# Altium schematic sheet ADC_CLK.SchDoc: {Наименование}
size 420 x 297 mm; DocumentNumber: НРДЦ.ХХХХХХ.ХХХ ХХ; SheetNumber: {}; SheetTotal: {}; PageSetup: Record=PageOptions|CenterHorizontal=False|CenterVertical=False|PrintScale=0.95|XCorrection=0.00|YCorrection=0.00|PrintKind=1|BorderSize=5000000|LeftOffset=0|BottomOffset=0|Orientation=1|PaperLength=1000|PaperWidth=1000|Scale=100|PaperSource=15|PrintQuality=600|MediaType=1|DitherType=10|PaperKind=A4|PrintScaleMode=1; Rule: PcbType=ProtelPcb
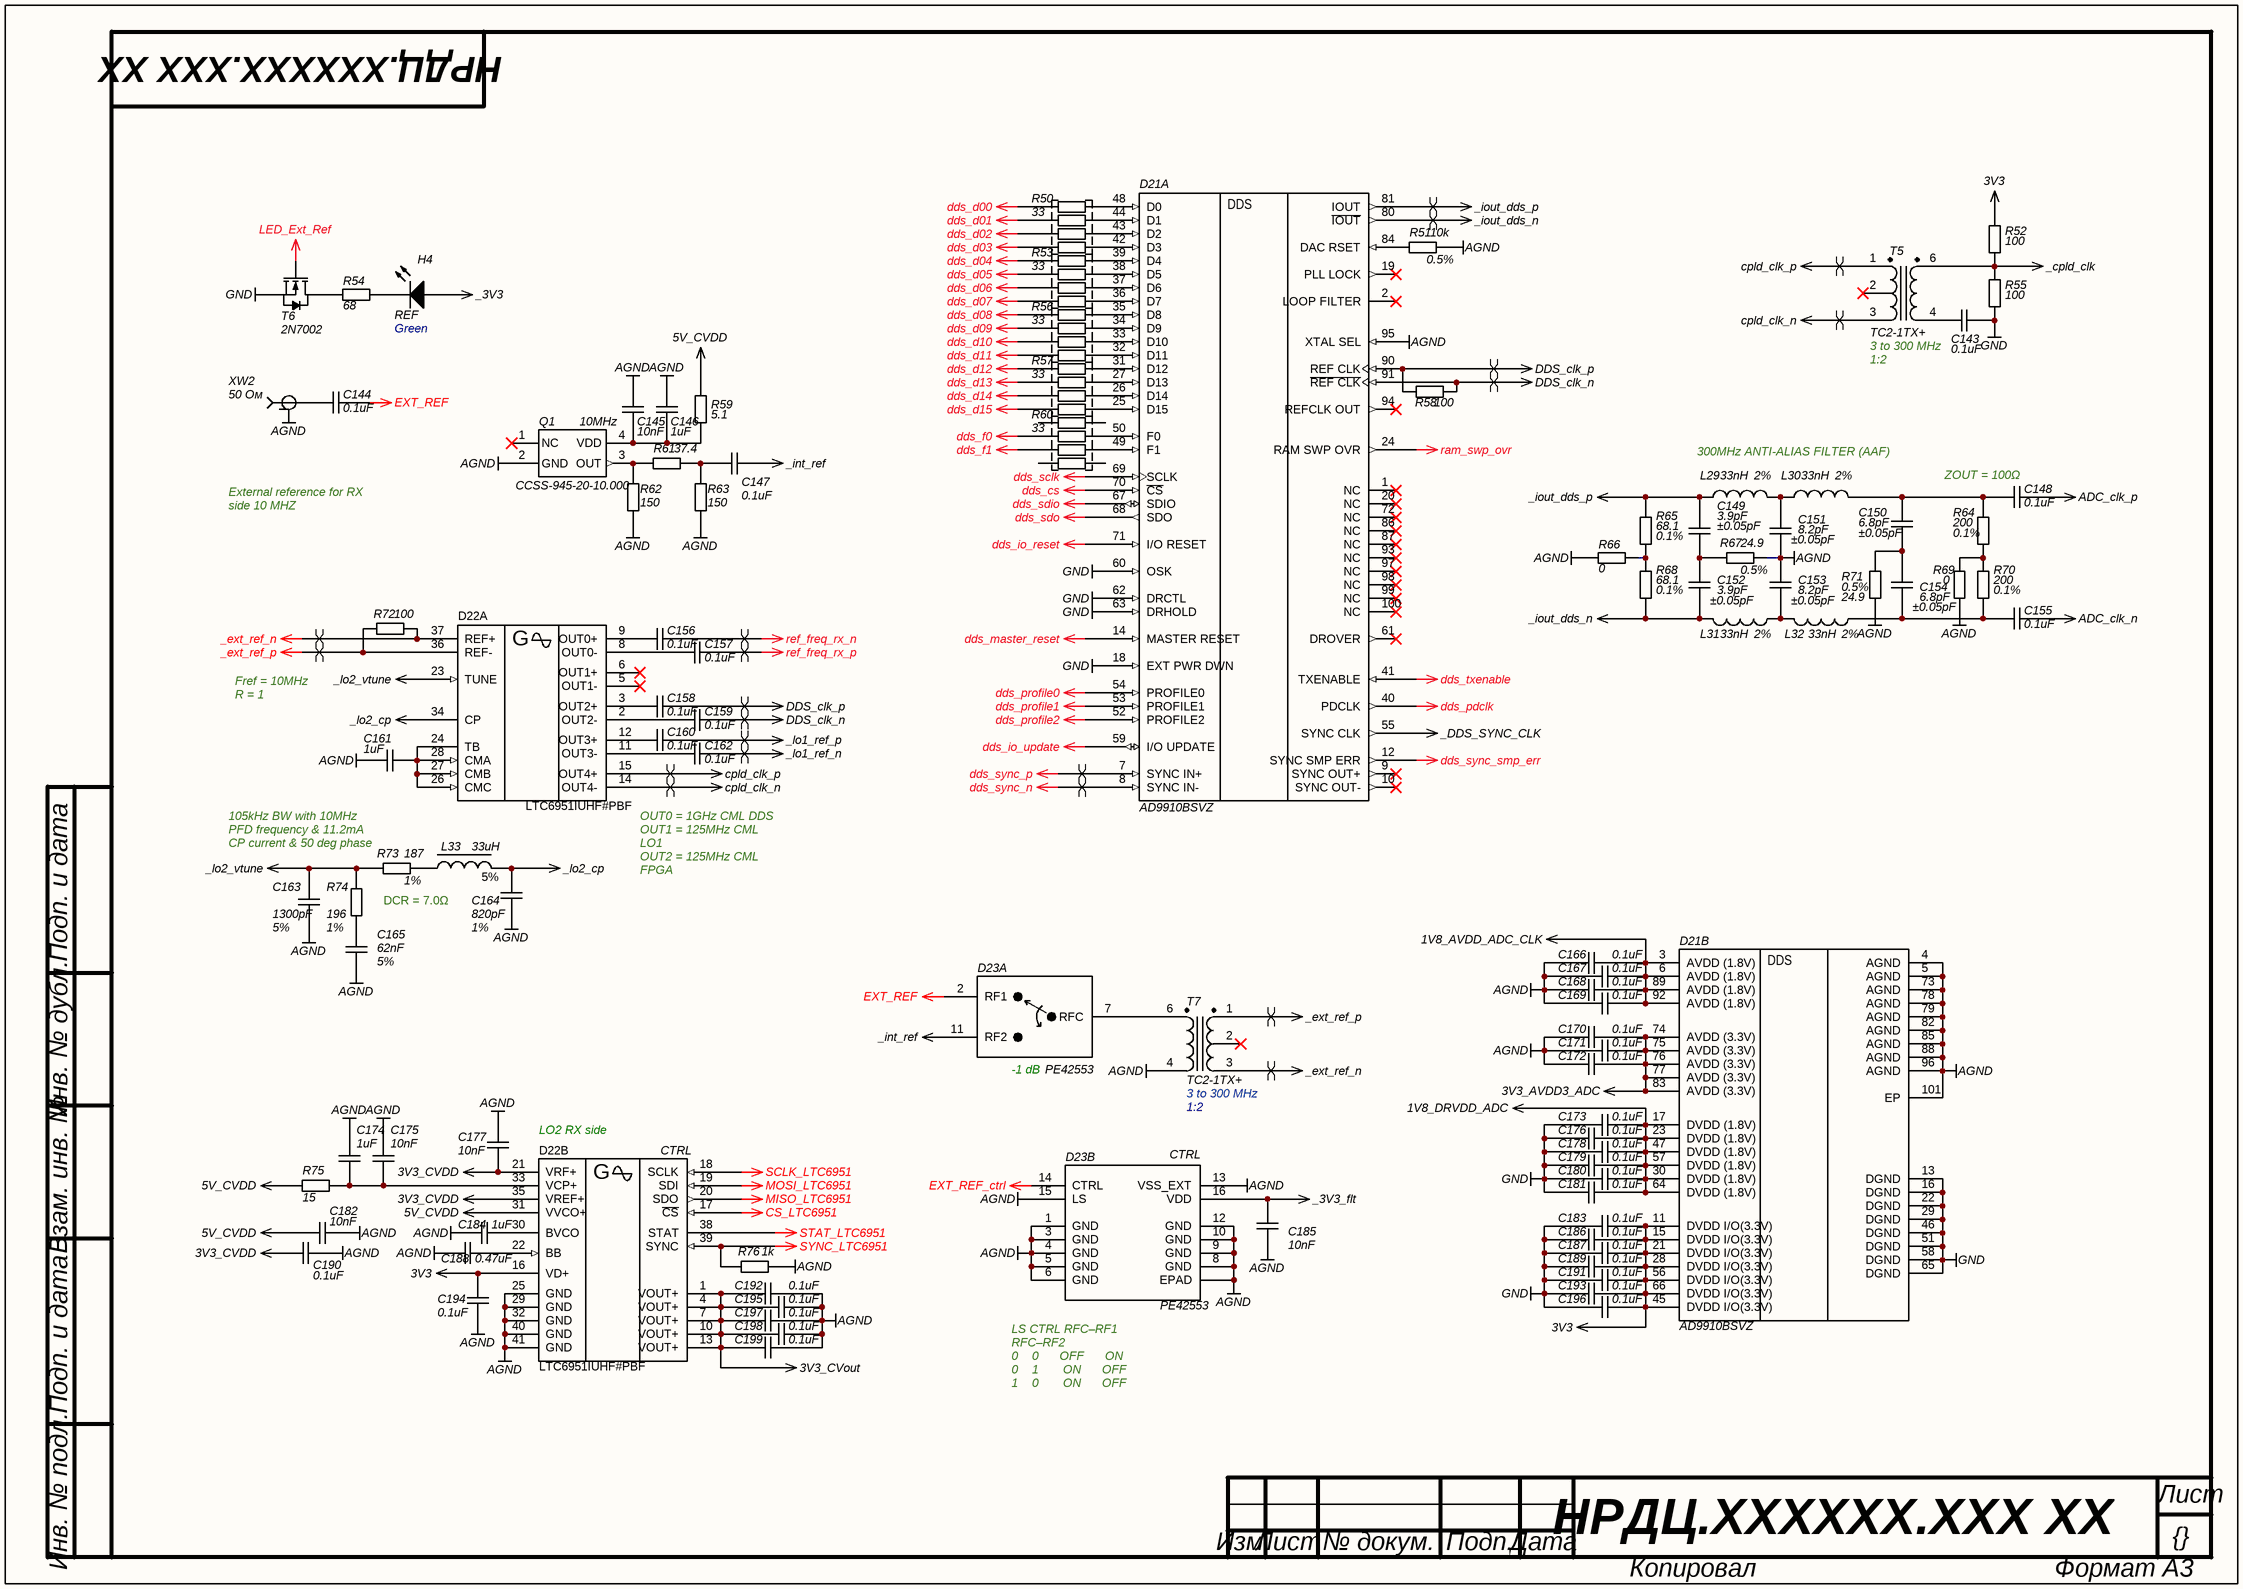
[diagram p0: ADC_CLK.SchDoc]

## Parts
C143  value 0.1uF  [C0402]  (hidden comment: CAP)
C144  value 0.1uF  [C0402]  (hidden comment: CAP)
C145  value 10nF  [C0402]  (hidden comment: CAP)
C146  value 1uF  [C0805]  (hidden comment: CAP)
C147  value 0.1uF  [C0402]  (hidden comment: CAP)
C148  value 0.1uF  [C0402]  (hidden comment: CAP)
C149  value 3.9pF  Tolerance: ±0.05pF  [C0402]  (hidden comment: CAP)
C150  value 6.8pF  Tolerance: ±0.05pF  [C0402]  (hidden comment: CAP)
C151  value 8.2pF  Tolerance: ±0.05pF  [C0402]  (hidden comment: CAP)
C152  value 3.9pF  Tolerance: ±0.05pF  [C0402]  (hidden comment: CAP)
C153  value 8.2pF  Tolerance: ±0.05pF  [C0402]  (hidden comment: CAP)
C154  value 6.8pF  Tolerance: ±0.05pF  [C0402]  (hidden comment: CAP)
C155  value 0.1uF  [C0402]  (hidden comment: CAP)
C156  value 0.1uF  [C0402]  (hidden comment: CAP)
C157  value 0.1uF  [C0402]  (hidden comment: CAP)
C158  value 0.1uF  [C0402]  (hidden comment: CAP)
C159  value 0.1uF  [C0402]  (hidden comment: CAP)
C160  value 0.1uF  [C0402]  (hidden comment: CAP)
C161  value 1uF  [C0402]  (hidden comment: CAP)
C162  value 0.1uF  [C0402]  (hidden comment: CAP)
C163  value 1300pF  Tolerance: 5%  [C0603]  (hidden comment: CAP)
C164  value 820pF  Tolerance: 1%  [C0603]  (hidden comment: CAP)
C165  value 62nF  Tolerance: 5%  [C1206]  (hidden comment: CAP)
C166  value 0.1uF  [C0402]  (hidden comment: CAP)
C167  value 0.1uF  [C0402]  (hidden comment: CAP)
C168  value 0.1uF  [C0402]  (hidden comment: CAP)
C169  value 0.1uF  [C0402]  (hidden comment: CAP)
C170  value 0.1uF  [C0402]  (hidden comment: CAP)
C171  value 0.1uF  [C0402]  (hidden comment: CAP)
C172  value 0.1uF  [C0402]  (hidden comment: CAP)
C173  value 0.1uF  [C0402]  (hidden comment: CAP)
C174  value 1uF  [C0805]  (hidden comment: CAP)
C175  value 10nF  [C0402]  (hidden comment: CAP)
C176  value 0.1uF  [C0402]  (hidden comment: CAP)
C177  value 10nF  [C0402]  (hidden comment: CAP)
C178  value 0.1uF  [C0402]  (hidden comment: CAP)
C179  value 0.1uF  [C0402]  (hidden comment: CAP)
C180  value 0.1uF  [C0402]  (hidden comment: CAP)
C181  value 0.1uF  [C0402]  (hidden comment: CAP)
C182  value 10nF  [C0402]  (hidden comment: CAP)
C183  value 0.1uF  [C0402]  (hidden comment: CAP)
C184  value 1uF  [C0402]  (hidden comment: CAP)
C185  value 10nF  [C0402]  (hidden comment: CAP)
C186  value 0.1uF  [C0402]  (hidden comment: CAP)
C187  value 0.1uF  [C0402]  (hidden comment: CAP)
C188  value 0.47uF  [C0603]  (hidden comment: CAP)
C189  value 0.1uF  [C0402]  (hidden comment: CAP)
C190  value 0.1uF  [C0402]  (hidden comment: CAP)
C191  value 0.1uF  [C0402]  (hidden comment: CAP)
C192  value 0.1uF  [C0402]  (hidden comment: CAP)
C193  value 0.1uF  [C0402]  (hidden comment: CAP)
C194  value 0.1uF  [C0402]  (hidden comment: CAP)
C195  value 0.1uF  [C0402]  (hidden comment: CAP)
C196  value 0.1uF  [C0402]  (hidden comment: CAP)
C197  value 0.1uF  [C0402]  (hidden comment: CAP)
C198  value 0.1uF  [C0402]  (hidden comment: CAP)
C199  value 0.1uF  [C0402]  (hidden comment: CAP)
D21  AD9910BSVZ  [Analog_Devices_SV-100-4_IPC_A]  (parts A,B of 2)
D22  LTC6951IUHF#PBF  [Analog_Devices_UHF-40-05-08-1951_IPC_A]  (parts A,B of 2)
D23  PE42553  [QFN-16]  (parts A,B of 2)
H4  REF  Color: Green  [LED]
L29  value 33nH  Tolerance: 2%  [L0603_HP]  (hidden comment: Inductor RF)
L30  value 33nH  Tolerance: 2%  [L0603_HP]  (hidden comment: Inductor RF)
L31  value 33nH  Tolerance: 2%  [L0603_HP]  (hidden comment: Inductor RF)
L32  value 33nH  Tolerance: 2%  [L0603_HP]  (hidden comment: Inductor RF)
L33  value 33uH  Tolerance: 5%  [L1008_LS]  (hidden comment: Inductor)
Q1  CCSS-945-20-10.000  Frequency: 10MHz  [CVCSO-914]
R50  value 33  [EXN8V]  (hidden comment: RES 4x0402)
R51  value 10k  Tolerance: 0.5%  [R0402]  (hidden comment: RES)
R52  value 100  [R0402]  (hidden comment: RES)
R53  value 33  [EXN8V]  (hidden comment: RES 4x0402)
R54  value 68  [R0402]  (hidden comment: RES)
R55  value 100  [R0402]  (hidden comment: RES)
R56  value 33  [EXN8V]  (hidden comment: RES 4x0402)
R57  value 33  [EXN8V]  (hidden comment: RES 4x0402)
R58  value 100  [R0402]  (hidden comment: RES)
R59  value 5.1  [R0603]  (hidden comment: RES)
R60  value 33  [EXN8V]  (hidden comment: RES 4x0402)
R61  value 37.4  [R0402]  (hidden comment: RES)
R62  value 150  [R0402]  (hidden comment: RES)
R63  value 150  [R0402]  (hidden comment: RES)
R64  value 200  Tolerance: 0.1%  [R0402]  (hidden comment: RES)
R65  value 68.1  Tolerance: 0.1%  [R0402]  (hidden comment: RES)
R66  value 0  [R0402]  (hidden comment: RES)
R67  value 24.9  Tolerance: 0.5%  [R0402]  (hidden comment: RES)
R68  value 68.1  Tolerance: 0.1%  [R0402]  (hidden comment: RES)
R69  value 0  [R0402]  (hidden comment: RES)
R70  value 200  Tolerance: 0.1%  [R0402]  (hidden comment: RES)
R71  value 24.9  Tolerance: 0.5%  [R0402]  (hidden comment: RES)
R72  value 100  [R0402]  (hidden comment: RES)
R73  value 187  Tolerance: 1%  [R0402]  (hidden comment: RES)
R74  value 196  Tolerance: 1%  [R0402]  (hidden comment: RES)
R75  value 15  [R0603]  (hidden comment: RES)
R76  value 1k  [R0402]  (hidden comment: RES)
T5  TC2-1TX+  Frequency: 3 to 300 MHz  Ratio: 1:2  [AT1521]
T6  2N7002  [SOT-23]
T7  TC2-1TX+  Frequency: 3 to 300 MHz  Ratio: 1:2  [AT1521]
XW2  50 Ом  [MOLEX SD-73251-135 (Gold)]

## Nets
1V8_AVDD_ADC_CLK: C166.2 C167.2 C168.2 C169.2 D21.3(AVDD_(1.8V)) D21.6(AVDD_(1.8V)) D21.89(AVDD_(1.8V)) D21.92(AVDD_(1.8V))
1V8_DRVDD_ADC: C173.2 C176.2 C178.2 C179.2 C180.2 C181.2 D21.17(DVDD_(1.8V)) D21.23(DVDD_(1.8V)) D21.30(DVDD_(1.8V)) D21.47(DVDD_(1.8V)) D21.57(DVDD_(1.8V)) D21.64(DVDD_(1.8V))
3V3: C183.2 C186.2 C187.2 C189.2 C191.2 C193.2 C194.2 C196.2 D21.11(DVDD_I/O(3.3V)) D21.15(DVDD_I/O(3.3V)) D21.21(DVDD_I/O(3.3V)) D21.28(DVDD_I/O(3.3V)) D21.45(DVDD_I/O(3.3V)) D21.56(DVDD_I/O(3.3V)) D21.66(DVDD_I/O(3.3V)) D22.16(VD+) R52.2
3V3_AVDD3_ADC: C170.2 C171.2 C172.2 D21.74(AVDD_(3.3V)) D21.75(AVDD_(3.3V)) D21.76(AVDD_(3.3V)) D21.77(AVDD_(3.3V)) D21.83(AVDD_(3.3V))
3V3_CVDD: C177.2 C190.2 D22.21(VRF+) D22.35(VREF+)
3V3_CVout: C192.1 C195.1 C197.1 C198.1 C199.1 D22.1(VOUT+) D22.4(VOUT+) D22.7(VOUT+) D22.10(VOUT+) D22.13(VOUT+)
5V_CVDD: C182.1 D22.31(VVCO+) R59.2 R75.2
_3V3: H4.2(A)
_3V3_flt: C185.1 D23.16(VDD)
_cpld_clk: R52.1 R55.2 T5.6
_DDS_SYNC_CLK: D21.55(SYNC_CLK)
_ext_ref_n: D22.37(REF+) R72.2 T7.3
_ext_ref_p: D22.36(REF-) R72.1 T7.1
_int_ref: C147.1 D23.11(RF2)
_iout_dds_n: C152.2 D21.80(~{IOUT}) L31.1 R68.2
_iout_dds_p: C149.1 D21.81(IOUT) L29.1 R65.1
_lo1_ref_n: C162.1
_lo1_ref_p: C160.1
_lo2_cp: C164.2 D22.34(CP) L33.2
_lo2_vtune: C163.2 D22.23(TUNE) R73.2 R74.1
ADC_clk_n: C155.1
ADC_clk_p: C148.1
AGND: C145.1 C146.1 C151.2 C153.1 C161.1 C163.1 C164.1 C165.1 C166.1 C167.1 C168.1 C169.1 C170.1 C171.1 C172.1 C174.1 C175.1 C177.1 C182.2 C184.1 C185.2 C188.2 C190.1 C192.2 C194.1 C195.2 C197.2 C198.2 C199.2 D21.4(AGND) D21.5(AGND) D21.73(AGND) D21.78(AGND) D21.79(AGND) D21.82(AGND) D21.85(AGND) D21.88(AGND) D21.95(XTAL_SEL) D21.96(AGND) D21.101(EP) D22.25(GND) D22.29(GND) D22.32(GND) D22.40(GND) D22.41(GND) D23.1(GND) D23.3(GND) D23.4(GND) D23.5(GND) D23.6(GND) D23.8(GND) D23.9(GND) D23.10(GND) D23.12(GND) D23.13(VSS_EXT) D23.15(LS) D23.17(EPAD) Q1.2(GND) R51.1 R62.2 R63.2 R66.1 R67.2 R69.2 R71.2 R76.1 T7.4 XW2.G(GND)
cpld_clk_n: D22.14(OUT4-) T5.3
cpld_clk_p: D22.15(OUT4+) T5.1
CS_LTC6951: D22.17(~{CS})
DDS_clk_n: C159.1 D21.91(~{REF_CLK}) R58.1
DDS_clk_p: C158.1 D21.90(REF_CLK) R58.2
dds_cs: D21.70(~{CS})
dds_d00: R50.4
dds_d01: R50.3
dds_d02: R50.2
dds_d03: R50.1
dds_d04: R53.4
dds_d05: R53.3
dds_d06: R53.2
dds_d07: R53.1
dds_d08: R56.4
dds_d09: R56.3
dds_d10: R56.2
dds_d11: R56.1
dds_d12: R57.4
dds_d13: R57.3
dds_d14: R57.2
dds_d15: R57.1
dds_f0: R60.3
dds_f1: R60.2
dds_io_reset: D21.71(I/O_RESET)
dds_io_update: D21.59(I/O_UPDATE)
dds_master_reset: D21.14(MASTER_RESET)
dds_pdclk: D21.40(PDCLK)
dds_profile0: D21.54(PROFILE0)
dds_profile1: D21.53(PROFILE1)
dds_profile2: D21.52(PROFILE2)
dds_sclk: D21.69(SCLK)
dds_sdio: D21.67(SDIO)
dds_sdo: D21.68(SDO)
dds_sync_n: D21.8(SYNC_IN-)
dds_sync_p: D21.7(SYNC_IN+)
dds_sync_smp_err: D21.12(SYNC_SMP_ERR)
dds_txenable: D21.41(TXENABLE)
EXT_REF: C144.1 D23.2(RF1)
EXT_REF_ctrl: D23.14(CTRL)
GND: C143.1 C173.1 C176.1 C178.1 C179.1 C180.1 C181.1 C183.1 C186.1 C187.1 C189.1 C191.1 C193.1 C196.1 D21.13(DGND) D21.16(DGND) D21.18(EXT_PWR_DWN) D21.22(DGND) D21.29(DGND) D21.46(DGND) D21.51(DGND) D21.58(DGND) D21.60(OSK) D21.62(DRCTL) D21.63(DRHOLD) D21.65(DGND) R55.1 T6.2(S)
LED_Ext_Ref: T6.1(G)
MISO_LTC6951: D22.20(SDO)
MOSI_LTC6951: D22.19(SDI)
ram_swp_ovr: D21.24(RAM_SWP_OVR)
ref_freq_rx_n: C156.1
ref_freq_rx_p: C157.1
SCLK_LTC6951: D22.18(SCLK)
STAT_LTC6951: D22.38(STAT)
SYNC_LTC6951: D22.39(SYNC) R76.2
NetC143_2: C143.2 T5.4
NetC144_2: C144.2 XW2.S(RF)
NetC145_2: C145.2 C146.2 Q1.4(VDD) R59.1
NetC147_2: C147.2 R61.1 R63.1
NetC148_2: C148.2 C150.1 L30.2 R64.1
NetC149_2: C149.2 C152.1 R67.1
NetC150_2: C150.2 C154.1 R71.1
NetC151_1: C151.1 L29.2 L30.1
NetC153_2: C153.2 L31.2 L32.1
NetC154_2: C154.2 C155.2 L32.2 R70.2
NetC156_2: C156.2 D22.9(OUT0+)
NetC157_2: C157.2 D22.8(OUT0-)
NetC158_2: C158.2 D22.3(OUT2+)
NetC159_2: C159.2 D22.2(OUT2-)
NetC160_2: C160.2 D22.12(OUT3+)
NetC161_2: C161.2 D22.24(TB) D22.26(CMC) D22.27(CMB) D22.28(CMA)
NetC162_2: C162.2 D22.11(OUT3-)
NetC165_2: C165.2 R74.2
NetC174_2: C174.2 C175.2 D22.33(VCP+) R75.1
NetC184_2: C184.2 D22.30(BVCO)
NetC188_1: C188.1 D22.22(BB)
NetD21_25: D21.25(D15) R57.8
NetD21_26: D21.26(D14) R57.7
NetD21_27: D21.27(D13) R57.6
NetD21_31: D21.31(D12) R57.5
NetD21_32: D21.32(D11) R56.8
NetD21_33: D21.33(D10) R56.7
NetD21_34: D21.34(D9) R56.6
NetD21_35: D21.35(D8) R56.5
NetD21_36: D21.36(D7) R53.8
NetD21_37: D21.37(D6) R53.7
NetD21_38: D21.38(D5) R53.6
NetD21_39: D21.39(D4) R53.5
NetD21_42: D21.42(D3) R50.8
NetD21_43: D21.43(D2) R50.7
NetD21_44: D21.44(D1) R50.6
NetD21_48: D21.48(D0) R50.5
NetD21_49: D21.49(F1) R60.7
NetD21_50: D21.50(F0) R60.6
NetD21_84: D21.84(DAC_RSET) R51.2
NetD23_7: D23.7(RFC) T7.6
NetH4_1: H4.1(K) R54.1
NetL33_1: L33.1 R73.1
NetQ1_3: Q1.3(OUT) R61.2 R62.1
NetR54_2: R54.2 T6.3(D)
NetR64_2: R64.2 R69.1 R70.1
NetR65_2: R65.2 R66.2 R68.1

Not connected (* = marked no-connect by the designer): D21 1(NC)* 2(LOOP_FILTER)* 9(SYNC_OUT+)* 10(SYNC_OUT-)* 19(PLL_LOCK)* 20(NC)* 61(DROVER)* 72(NC)* 86(NC)* 87(NC)* 93(NC)* 94(REFCLK_OUT)* 97(NC)* 98(NC)* 99(NC)* 100(NC)*; D22 5(OUT1-)* 6(OUT1+)*; Q1 1(NC)*; R60 1 4 5 8; T5 2*; T7 2*

## Layout directives
differential pair: _ext_ref_n, _ext_ref_p, _iout_dds_n, _iout_dds_p, _lo1_ref_n, _lo1_ref_p, cpld_clk_n, cpld_clk_p, DDS_clk_n, DDS_clk_p, dds_sync_n, dds_sync_p, ref_freq_rx_n, ref_freq_rx_p

## Notes on the sheet
- External reference for RX side 10 MHZ
- 300MHz ANTI-ALIAS FILTER (AAF)
- (near C148) ZOUT = 100Ω
- Fref = 10MHz
  R = 1
- (near R73) 105kHz BW with 10MHz PFD frequency & 11.2mA CP current & 50 deg phase margin
- DCR = 7.0Ω
- OUT0 = 1GHz CML DDS
  OUT1 = 125MHz CML LO1
  OUT2 = 125MHz CML FPGA
  OUT3 = NC CML
  OUT4 = 62.5MHz LVDS CPLD
- LO2 RX side
- (near D23) LS CTRL RFC–RF1 RFC–RF2
  0    0      OFF      ON
  0    1       ON      OFF
  1    0       ON      OFF
  1    1      OFF      ON
- Подп. и дата
- Инв. № дубл.
- Взам. инв. №
- Инв. № подл.
- Лист
- Изм.
- № докум.
- Подп.
- Дата
- Копировал
- Формат А3
- (in symbol AD9910, part A) DDS
- (in symbol AD9910, part B) DDS
- (in symbol LTC6951, part A) G
- (in symbol LTC6951, part B) CTRL; G
- (in symbol PE42553, part A) -1 dB

## Library data of the parts
C143 C144 C147 C148 C155-C160 C162 C190 C194 = CAP: SMD Capacitor; Manufacturer: Murata; Material: X7R; Tolerance: 10%; Voltage: 10V; Type: Ceramic Capacitor; P/N: GRM155R71A104KA01J
C145 C175 C177 C182 C185 = CAP: SMD Capacitor; Manufacturer: Murata; Material: X7R; Tolerance: 10%; Voltage: 25V; Type: Ceramic Capacitor; P/N: GRM155R71E103KA01D
C146 C174 = CAP: SMD Capacitor; Manufacturer: Murata; Material: X7R; Tolerance: 10%; Voltage: 10V; Type: Ceramic Capacitor; P/N: GRM21BR71A105KA01K
C149 C152 = CAP: SMD Capacitor; Manufacturer: Murata; Material: NP0; Voltage: 50V; Type: Ceramic Capacitor; P/N: GJM1555C1H3R9WB01D
C150 C154 = CAP: SMD Capacitor; Manufacturer: Murata; Material: NP0; Voltage: 50V; Type: Ceramic Capacitor; P/N: GJM1555C1H6R8WB01D
C151 C153 = CAP: SMD Capacitor; Manufacturer: Murata; Material: NP0; Voltage: 50V; Type: Ceramic Capacitor; P/N: GJM1555C1H8R2WB01D
C161 C184 = CAP: SMD Capacitor; Manufacturer: Murata; Material: X7R; Tolerance: 10%; Voltage: 6.3V; Type: Ceramic Capacitor; P/N: GRM155R70J105KA12J
C163 = CAP: SMD Capacitor; Manufacturer: Murata; Material: NP0; Voltage: 50V; Type: Ceramic Capacitor; P/N: GRM1885C1H132JA01D
C164 = CAP: SMD Capacitor; Manufacturer: Murata; Material: NP0; Voltage: 100V; Type: Ceramic Capacitor; P/N: GCM1885C2A821FA16D
C165 = CAP: SMD Capacitor; Manufacturer: Murata; Material: NP0; Voltage: 50V; Type: Ceramic Capacitor; P/N: GRM31C5C1H623JA01K
C166-C173 C176 C178-C181 C183 C186 C187 C189 C191-C193 C195-C199 = CAP: SMD Capacitor; Manufacturer: Murata; Material: X7R; Tolerance: 10%; Voltage: 16V; Type: Ceramic Capacitor; P/N: GRM155R71C104KA88J
C188 = CAP: SMD Capacitor; Manufacturer: Murata; Material: X7R; Tolerance: 10%; Voltage: 16V; Type: Ceramic Capacitor; P/N: GCM188R71C474KA55D
D21 = AD9910: 1 GSPS, 14-Bit, 3.3 V CMOS / Direct Digital Synthesizer; P/N: AD9910BSVZ; Name: AD9910
D22 = LTC6951: Ultralow Jitter / Multioutput Clock Synthesizer / with Integrated VCO; Name: LTC6951; P/N: LTC6951IUHF#PBF
D23 = PE42553: HaRPTM technology-enhanced absorptive SPDT; Manufacturer: Peregrine Technical Solutions; P/N: PE42553A-Z; Type: SPDT RF Switch; Name: PE42553; Package: 16-lead 3 × 3 mm QFN; Supplier 1: Digi-Key; Supplier Part Number 1: 1046-1137-1-ND
H4 = LED: CHIP LED LAMP; Manufacturer: Kingbright; Name: APHCM2012; P/N: APHCM2012CGCK-F01; Package: 2.0 x 1.25 mm SMD; Type: CHIP LED LAMP; Supplier 1: Digi-Key; Supplier Part Number 1: 754-1094-1-ND
L29-L32 = Inductor RF: Chip SMD Inductor; Manufacturer: Coilcraft; Current: 680mA; Frequency: 2.7GHz; Name: 0603HP-33NXGE; Series: 0603HP; Temperature Range: -25…85°C; P/N: 0603HP-33NXGE
L33 = Inductor: Chip SMD Inductor; Manufacturer: Coilcraft; Current: 200mA; Frequency: 32MHz; Name: 1008LS; P/N: 1008LS-333XJE; DCR: 7.0Ω; Series: 1008LS; Temperature Range: -25…85°C
Q1 = CCSS-945: Ultra Low Noise / SineWave Clock Oscillator; Input Current: 15mA Typical; Name: CCSS-945-10; Output: Unsymmetry; Output Current: ±24mA Max; Voltage: 5.0V; Package: 9×14 mm SMD; Temperature Range: 0°C to +70°C; P/N: CCSS-945-20-10.000; Type: SineWave Clock Oscillator
R50 R53 R56 R57 R60 = RES 4x0402: Chip Resistor Array; Manufacturer: Panasonic; Name: EXBN8V; Number of Resistors: 4; Tolerance: 5%; P/N: ERJ-2GEJ330X; Type: 0402 Array Concave Terminal; Number of Terminals: 8; Series: EXB
R51 = RES: SMD Resistor; Manufacturer: Panasonic Electronic Components; Name: Chip SMD Resistor; Power: 0.063 Wt; P/N: ERA-2AED103X; Temperature Range: -55…155°C
R52 R55 R58 R72 = RES: SMD Resistor; Manufacturer: Panasonic Electronic Components; Name: Chip SMD Resistor; Power: 0.062 Wt; Tolerance: 5%; P/N: ERJ-2GEJ101X; Temperature Range: -55…155°C
R54 = RES: SMD Resistor; Name: Chip SMD Resistor; Power: 0.062 Wt; Tolerance: 5%; P/N: ERJ-2GEJ680X; Temperature Range: -55…155°C
R59 = RES: SMD Resistor; Name: Chip SMD Resistor; Power: 0.1 Wt; Tolerance: 5%; P/N: ERJ-2GEJ5R1X; Temperature Range: -55…155°C
R61 = RES: SMD Resistor; Manufacturer: Panasonic Electronic Components; Name: Chip SMD Resistor; Power: 0.062 Wt; Tolerance: 5%; P/N: ERJ-2RKF37R4X; Temperature Range: -55…155°C
R62 R63 = RES: SMD Resistor; Manufacturer: Panasonic Electronic Components; Name: Chip SMD Resistor; Power: 0.062 Wt; Tolerance: 1%; P/N: ERJ-2RKF1500X; Temperature Range: -55…155°C
R64 R70 = RES: SMD Resistor; Manufacturer: Panasonic Electronic Components; Name: Chip SMD Resistor; Power: 0.063 Wt; P/N: ERA-2AEB201X; Temperature Range: -55…155°C
R65 R68 = RES: SMD Resistor; Manufacturer: Panasonic Electronic Components; Name: Chip SMD Resistor; Power: 0.063 Wt; P/N: ERA-2AEB68R1X; Temperature Range: -55…155°C
R66 R69 = RES: SMD Resistor; Name: Chip SMD Resistor; Power: 0.1 Wt; Tolerance: 1%; P/N: ERJ-2GE0R00X; Temperature Range: -55…155°C
R67 R71 = RES: SMD Resistor; Manufacturer: Panasonic Electronic Components; Name: Chip SMD Resistor; Power: 0.063 Wt; P/N: ERJ-2RKD24R9X; Temperature Range: -55…155°C
R73 = RES: SMD Resistor; Manufacturer: Panasonic Electronic Components; Name: Chip SMD Resistor; Power: 0.2 Wt; P/N: ERJ-2RKF1870X; Temperature Range: -55…155°C
R74 = RES: SMD Resistor; Manufacturer: Panasonic Electronic Components; Name: Chip SMD Resistor; Power: 0.2 Wt; P/N: ERJ-2RKF1960X; Temperature Range: -55…155°C
R75 = RES: SMD Resistor; Name: Chip SMD Resistor; Power: 0.1 Wt; Tolerance: 1%; P/N: ERJ-3EKF15R0V; Temperature Range: -55…155°C
R76 = RES: SMD Resistor; Manufacturer: Panasonic Electronic Components; Name: Chip SMD Resistor; Power: 0.062 Wt; Tolerance: 5%; P/N: ERJ-2GEJ102X; Temperature Range: -55…155°C
T5 T7 = TC2-1TX+: RF Transformer; Manufacturer: Mini-Circuits; Name: TC2-1TX+; P/N: TC2-1TX+; Type: RF Transformer; Package: AT1521
T6 = 2N7002: N-Channel MOSFET 2N7002; Channel Resistance: 5Ohm; Current: 300mA; Power Dissipation: 0.83W; Voltage: 60V; Name: 2N7002; Type: SOT-23; Package: SOT-23
XW2 = RF Connector: 50 Ohms, SMA Jack, Vertica; Manufacturer: Molex; Impedance: 50Ω; P/N: 0732511352; Name: SMA Jack; Type: 50 Ohms, SMA Jack, Vertical, PCB SMT, Gold (Au) Body; Supplier 1: Digi-Key; Supplier Part Number 1: WM9458-ND